# EAGLE schematic DMM-8E-2 (EAGLE 6.6.0)
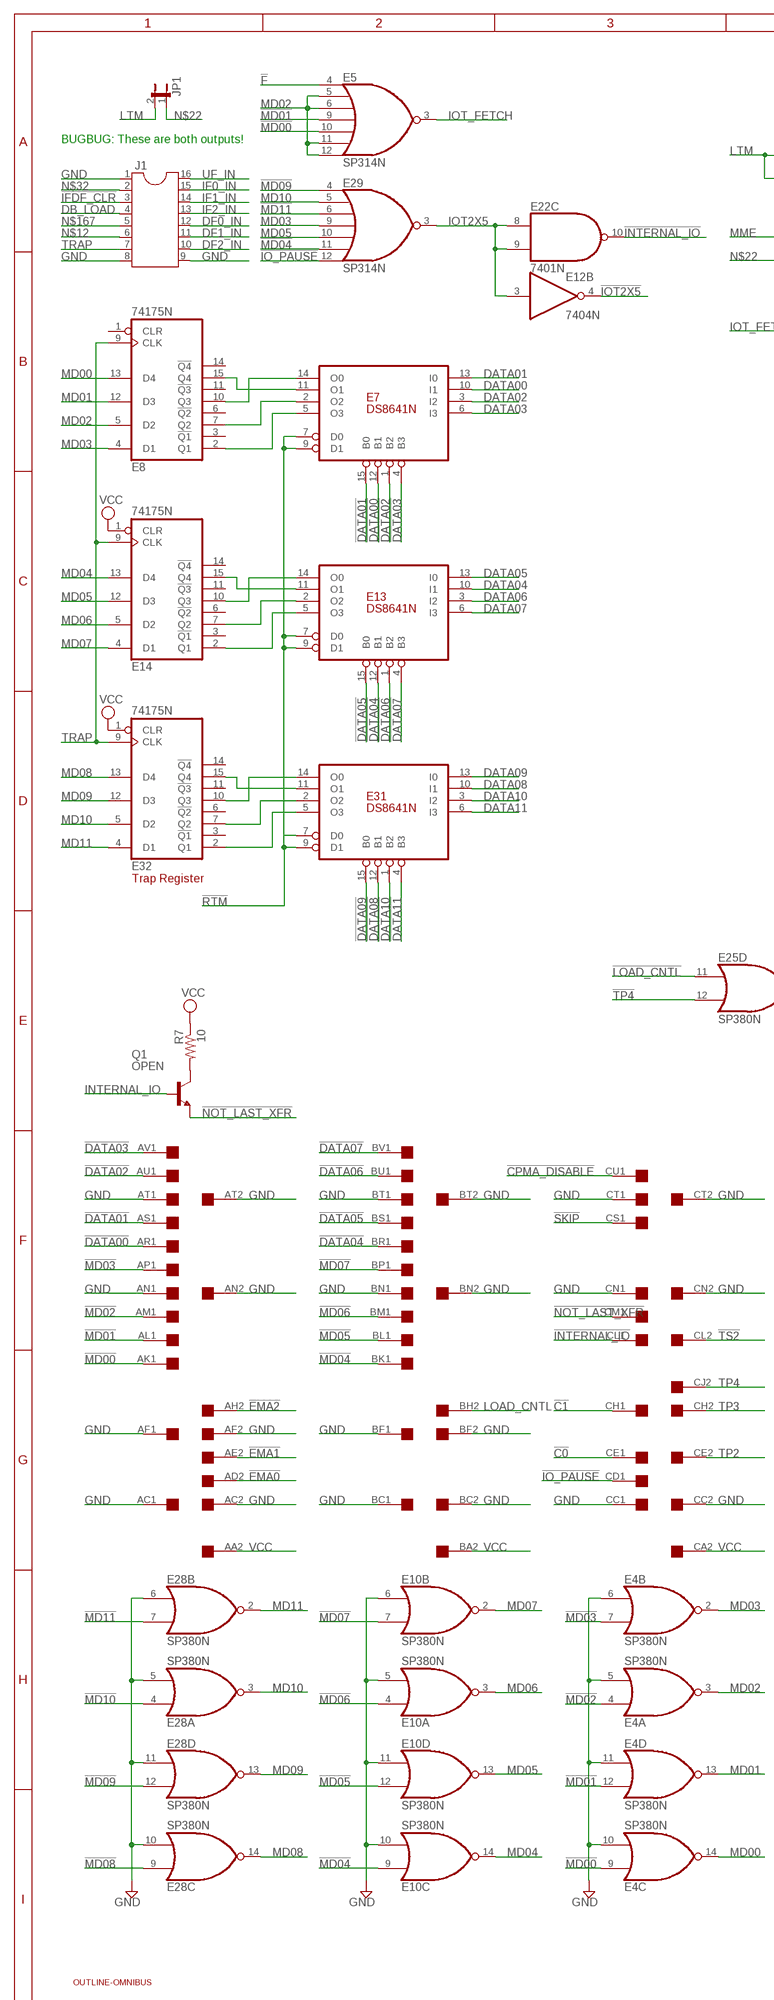
[diagram p0: schematic, sheet 1, part 1 of 2]
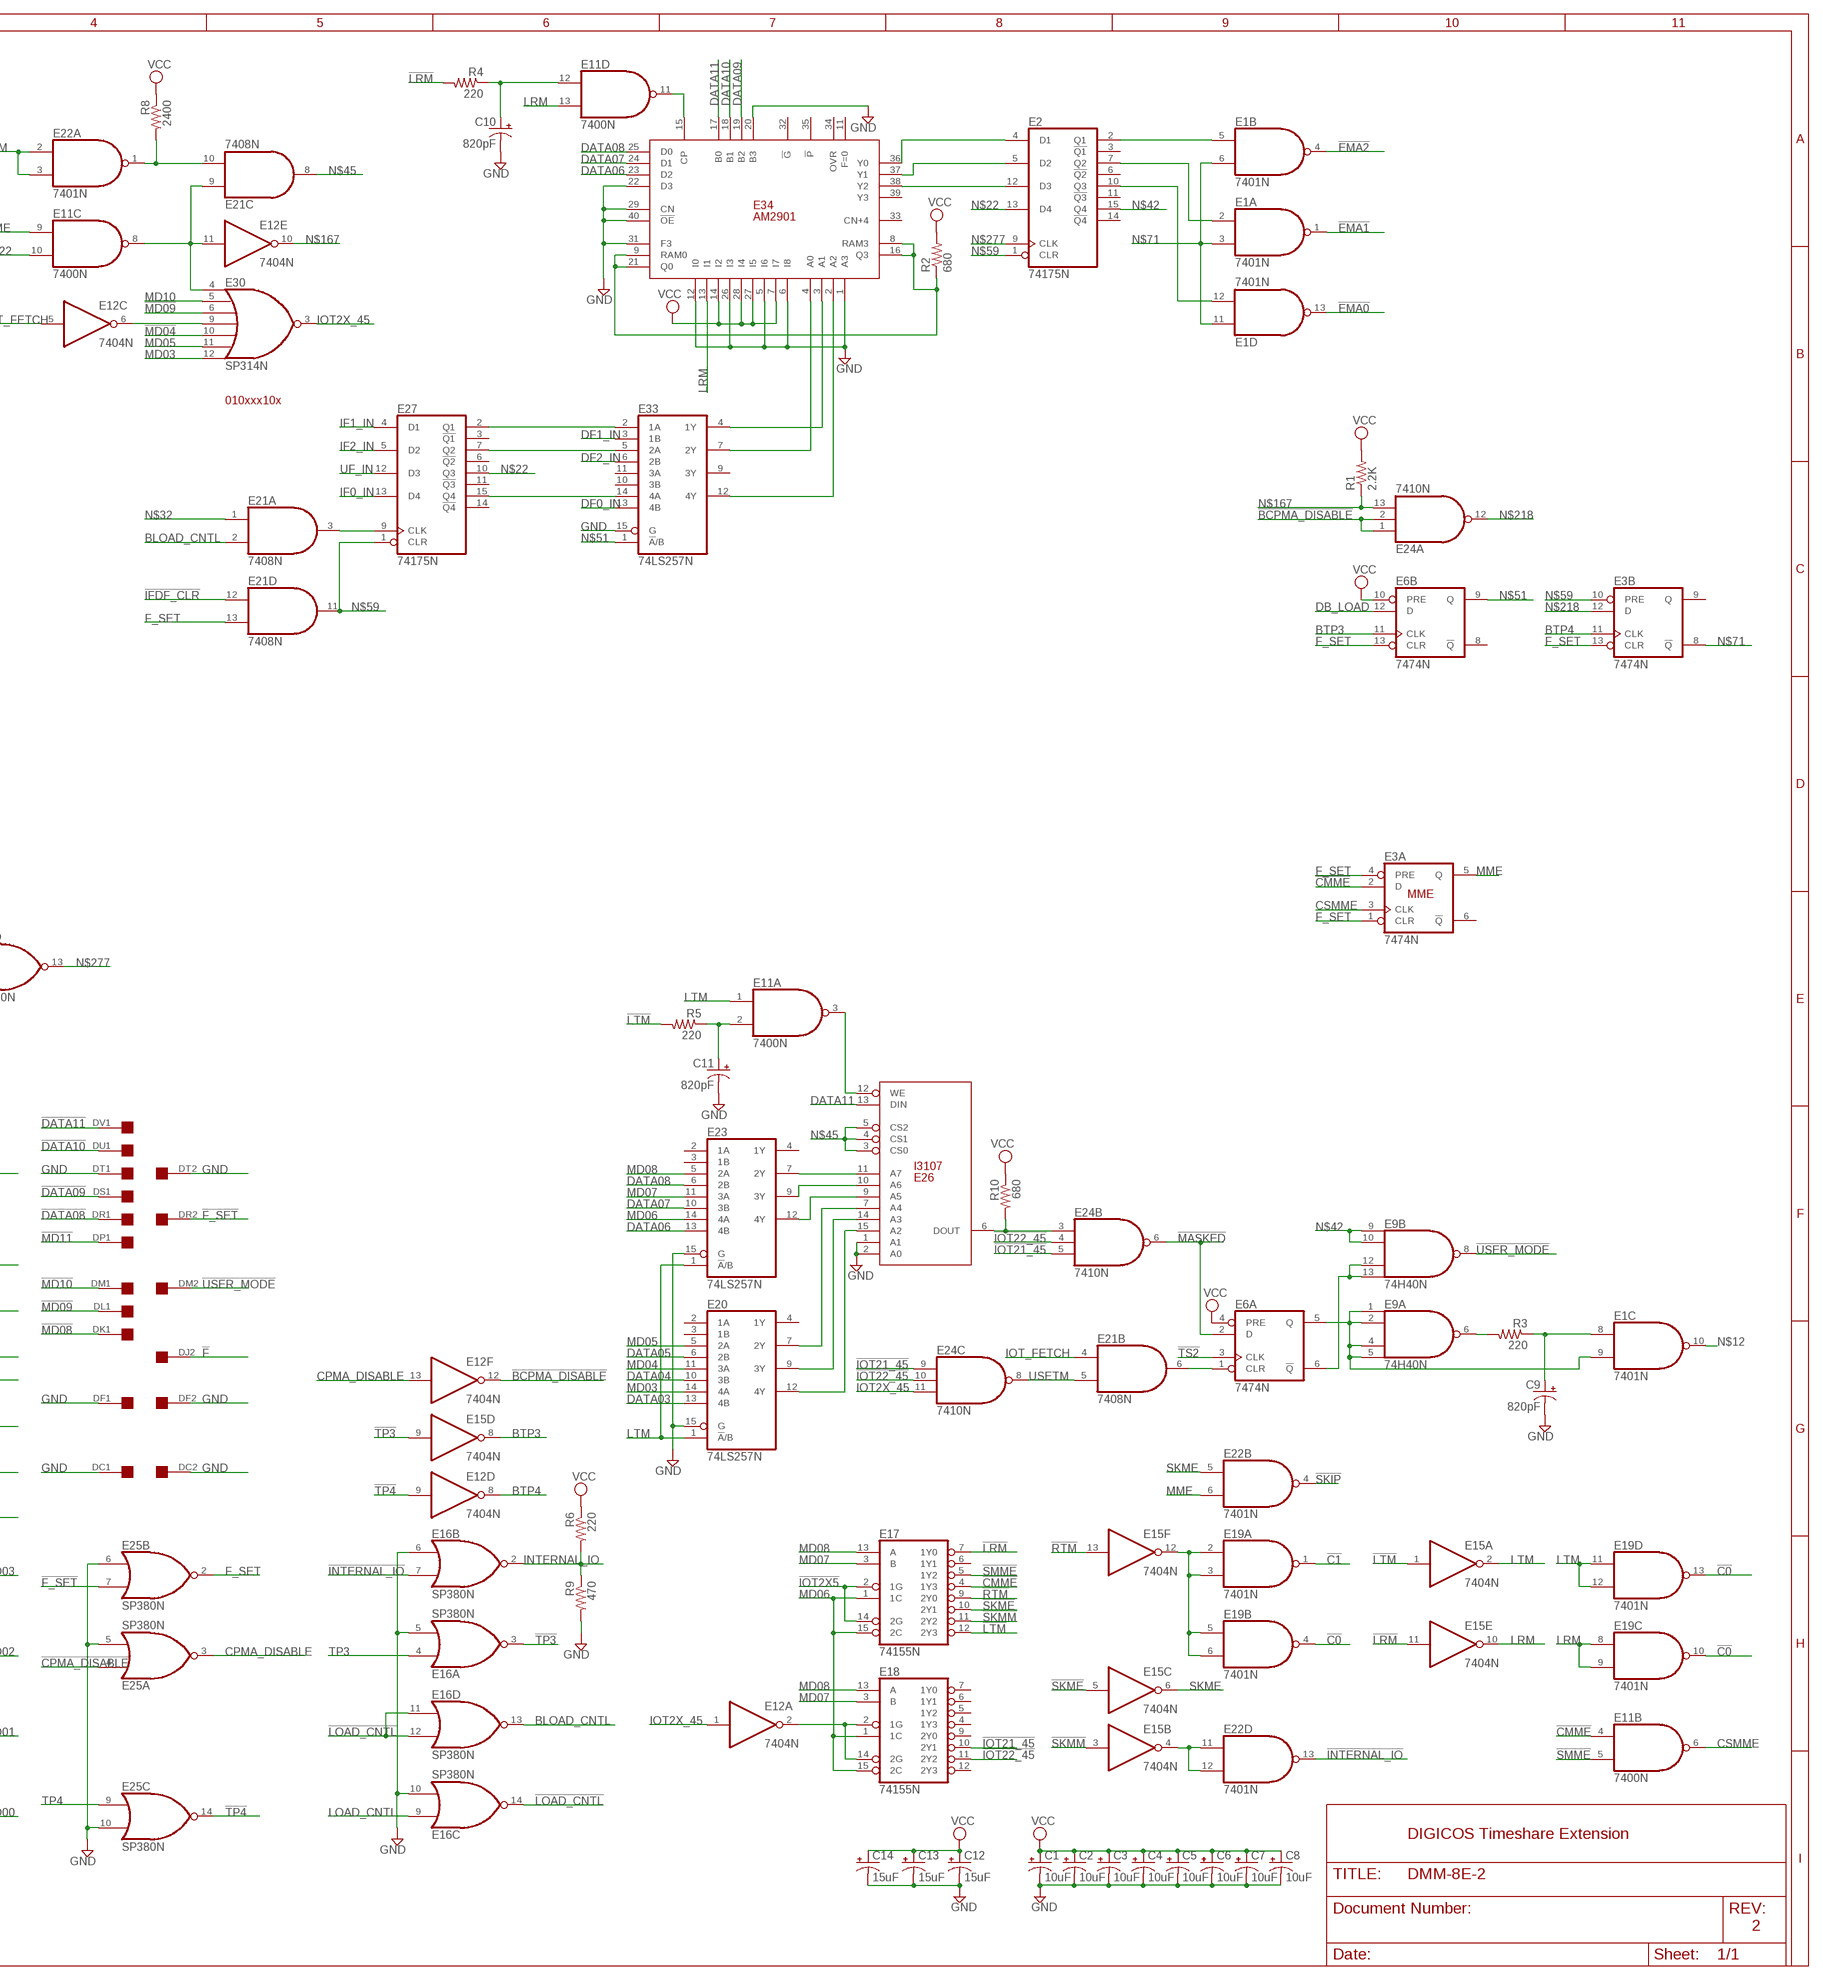
[diagram p1: schematic, sheet 1, part 2 of 2]

## Parts
C1  10uF  CPOL-USE15-5AXIAL  [E15-5]
C2  10uF  CPOL-USE15-5AXIAL  [E15-5]
C3  10uF  CPOL-USE15-5AXIAL  [E15-5]
C4  10uF  CPOL-USE15-5AXIAL  [E15-5]
C5  10uF  CPOL-USE15-5AXIAL  [E15-5]
C6  10uF  CPOL-USE15-5AXIAL  [E15-5]
C7  10uF  CPOL-USE15-5AXIAL  [E15-5]
C8  10uF  CPOL-USE15-5AXIAL  [E15-5]
C9  820pF  CPOL-USB45181C  [B45181C]
C10  820pF  CPOL-USB45181C  [B45181C]
C11  820pF  CPOL-USB45181C  [B45181C]
C12  15uF  CPOL-USTT5D7  [TT5D7]
C13  15uF  CPOL-USTT5D7  [TT5D7]
C14  15uF  CPOL-USTT5D7  [TT5D7]
E1  7401N  74LS01N  [DIL14]
E2  74175N  [DIL16]
E3  7474N  74LS74N  [DIL14]
E4  SP380N  [DIL14]
E5  SP314N  [DIL14]
E6  7474N  74LS74N  [DIL14]
E7  DS8641N  [DIL16]
E8  74175N  [DIL16]
E9  74H40N  7440N  [DIL14]
E10  SP380N  [DIL14]
E11  7400N  [DIL14]
E12  7404N  [DIL14]
E13  DS8641N  [DIL16]
E14  74175N  [DIL16]
E15  7404N  [DIL14]
E16  SP380N  [DIL14]
E17  74155N  [DIL16]
E18  74155N  [DIL16]
E19  7401N  74LS01N  [DIL14]
E20  74LS257N  [DIL16]
E21  7408N  74LS08N  [DIL14]
E22  7401N  74LS01N  [DIL14]
E23  74LS257N  [DIL16]
E24  7410N  [DIL14]
E25  SP380N  [DIL14]
E26  I3107  [DIL16]
E27  74175N  [DIL16]
E28  SP380N  [DIL14]
E29  SP314N  [DIL14]
E30  SP314N  [DIL14]
E31  DS8641N  [DIL16]
E32  74175N  [DIL16]
E33  74LS257N  [DIL16]
E34  AM2901  [DIL40]
J1  DIL16S  [SOCKET-16]
JP1  JP1E  [JP1]
Q1  OPEN  -NPN-TO5  [TO5]
R1  2.2K  R-US_0207/10  [0207/10]
R2  680  R-US_0207/10  [0207/10]
R3  220  R-US_0207/10  [0207/10]
R4  220  R-US_0207/10  [0207/10]
R5  220  R-US_0207/10  [0207/10]
R6  220  R-US_0207/10  [0207/10]
R7  10  R-US_0207/10  [0207/10]
R8  2400  R-US_0207/10  [0207/10]
R9  470  R-US_0207/10  [0207/10]
R10  680  R-US_0207/10  [0207/10]
U$1  OUTLINE-OMNIBUS  [OMNIBUS]
U$2  QUAD  [EDGE-CON8]

## Nets
!BCPMA_DISABLE: E12.12(F:O) E24.1(A:I0) E24.2(A:I1)
!C0: E19.4(B:O) E19.10(C:O) E19.13(D:O) U$2.CE1
!C1: E19.1(A:O) U$2.CH1
!CMME: E3.2(A:D) E11.4(B:I0) E17.4(1Y3)
!CPMA_DISABLE: E25.4(A:I0) U$2.CU1
!DATA00: E7.12(B1) U$2.AR1
!DATA01: E7.15(B0) U$2.AS1
!DATA02: E7.1(B2) U$2.AU1
!DATA03: E7.4(B3) U$2.AV1
!DATA04: E13.12(B1) U$2.BR1
!DATA05: E13.15(B0) U$2.BS1
!DATA06: E13.1(B2) U$2.BU1
!DATA07: E13.4(B3) U$2.BV1
!DATA08: E31.12(B1) U$2.DR1
!DATA09: E31.15(B0) U$2.DS1
!DATA10: E31.1(B2) U$2.DU1
!DATA11: E31.4(B3) U$2.DV1
!EMA0: E1.13(D:O) U$2.AD2
!EMA1: E1.1(A:O) U$2.AE2
!EMA2: E1.4(B:O) U$2.AH2
!F: E5.4(I0) U$2.DJ2
!F_SET: E25.7(B:I1) U$2.DR2
!IFDF_CLR: E21.12(D:I0) J1.3
!INTERNAL_IO: E16.7(B:I1) E22.10(C:O) E22.13(D:O) U$2.CL1
!IO_PAUSE: E29.12(I6) U$2.CD1
!IOT2X5: E12.4(B:O) E17.2(1G) E17.14(2G)
!IOT21_45: E18.10(2Y1) E24.5(B:I2) E24.9(C:I0)
!IOT22_45: E18.11(2Y2) E24.4(B:I1) E24.10(C:I1)
!LOAD_CNTL: E16.11(D:I0) E16.12(D:I1) E16.14(C:O) E25.11(D:I0)
!LRM: E15.11(E:I) E17.7(1Y0) R4.2
!LTM: E15.1(A:I) E17.12(2Y3) R5.2
!MASKED: E6.2(A:D) E24.6(B:O)
!MD00: E4.9(C:I0) E5.10(I4) U$2.AK1
!MD01: E4.12(D:I1) E5.9(I3) U$2.AL1
!MD02: E4.4(A:I0) U$2.AM1
!MD03: E4.7(B:I1) U$2.AP1
!MD04: E10.9(C:I0) E29.11(I5) E30.10(I4) U$2.BK1
!MD05: E10.12(D:I1) U$2.BL1
!MD06: E10.4(A:I0) U$2.BM1
!MD07: E10.7(B:I1) U$2.BP1
!MD08: E28.9(C:I0) U$2.DK1
!MD09: E28.12(D:I1) E29.4(I0) E30.6(I2) U$2.DL1
!MD10: E28.4(A:I0) U$2.DM1
!MD11: E28.7(B:I1) E29.6(I2) U$2.DP1
!NOT_LAST_XFR: Q1.1(E) U$2.CM1
!RTM: E7.7(D0) E7.9(D1) E13.7(D0) E13.9(D1) E15.13(F:I) E17.9(2Y0) E31.7(D0) E31.9(D1)
!SKIP: E22.4(B:O) U$2.CS1
!SKME: E15.5(C:I) E17.10(2Y1)
!SKMM: E15.3(B:I) E17.11(2Y2)
!SMME: E11.5(B:I1) E17.5(1Y2)
!TP3: E15.9(D:I) E16.3(A:O)
!TP4: E12.9(D:I) E25.12(D:I1) E25.14(C:O)
!TS2: E6.3(A:CLK) U$2.CL2
!USER_MODE: E9.8(B:O) U$2.DM2
BLOAD_CNTL: E16.13(D:O) E21.2(A:I1)
BTP3: E6.11(B:CLK) E15.8(D:O)
BTP4: E3.11(B:CLK) E12.8(D:O)
CPMA_DISABLE: E12.13(F:I) E25.3(A:O)
CSMME: E3.3(A:CLK) E11.6(B:O)
DATA00: E7.10(I1)
DATA01: E7.13(I0)
DATA02: E7.3(I2)
DATA03: E7.6(I3) E20.13(4B)
DATA04: E13.10(I1) E20.10(3B)
DATA05: E13.13(I0) E20.6(2B)
DATA06: E13.3(I2) E23.13(4B) E34.23(D2)
DATA07: E13.6(I3) E23.10(3B) E34.24(D1)
DATA08: E23.6(2B) E31.10(I1) E34.25(D0)
DATA09: E31.13(I0) E34.19(B2)
DATA10: E31.3(I2) E34.18(B1)
DATA11: E26.13(DIN) E31.6(I3) E34.17(B0)
DB_LOAD: E6.12(B:D) J1.4
DF0_IN: E33.13(4B) J1.12
DF1_IN: E33.3(1B) J1.11
DF2_IN: E33.6(2B) J1.10
F_SET: E3.1(A:CLR) E3.4(A:PRE) E3.13(B:CLR) E6.13(B:CLR) E21.13(D:I1) E25.2(B:O)
GND: C1.- C2.- C3.- C4.- C5.- C6.- C7.- C8.- C9.- C10.- C11.- C12.- C13.- C14.- E4.5(A:I1) E4.6(B:I0) E4.10(C:I1) E4.11(D:I0) E10.5(A:I1) E10.6(B:I0) E10.10(C:I1) E10.11(D:I0) E16.5(A:I1) E16.6(B:I0) E16.10(C:I1) E20.15(G) E23.15(G) E25.5(A:I1) E25.6(B:I0) E25.10(C:I1) E26.1(A1) E26.2(A0) E28.5(A:I1) E28.6(B:I0) E28.10(C:I1) E28.11(D:I0) E33.15(G) E34.1(A3) E34.5(I6) E34.6(I8) E34.12(I0) E34.20(B3) E34.22(D3) E34.26(I3) E34.29(CN) E34.31(F3) E34.40(!OE) J1.1 J1.8 J1.9 R9.2 U$2.AC1 U$2.AC2 U$2.AF1 U$2.AF2 U$2.AN1 U$2.AN2 U$2.AT1 U$2.AT2 U$2.BC1 U$2.BC2 U$2.BF1 U$2.BF2 U$2.BN1 U$2.BN2 U$2.BT1 U$2.BT2 U$2.CC1 U$2.CC2 U$2.CN1 U$2.CN2 U$2.CT1 U$2.CT2 U$2.DC1 U$2.DC2 U$2.DF1 U$2.DF2 U$2.DT1 U$2.DT2
IF0_IN: E27.13(D4) J1.15
IF1_IN: E27.4(D1) J1.14
IF2_IN: E27.5(D2) J1.13
INTERNAL_IO: E16.2(B:O) Q1.2(B) R6.2 R9.1
IOT2X5: E12.3(B:I) E22.8(C:I0) E22.9(C:I1) E29.3(O)
IOT2X_45: E12.1(A:I) E24.11(C:I2) E30.3(O)
IOT_FETCH: E5.3(O) E12.5(C:I) E21.4(B:I0)
LOAD_CNTL: E16.9(C:I0) U$2.BH2
LRM: E11.13(D:I1) E15.10(E:O) E19.8(C:I0) E19.9(C:I1) E34.13(I1)
LTM: E11.1(A:I0) E15.2(A:O) E19.11(D:I0) E19.12(D:I1) E20.1(!A!/B) E22.2(A:I0) E22.3(A:I1) E23.1(!A!/B) JP1.2
MD00: E4.14(C:O) E8.13(D4)
MD01: E4.13(D:O) E8.12(D3)
MD02: E4.3(A:O) E5.5(I1) E5.6(I2) E5.11(I5) E5.12(I6) E8.5(D2)
MD03: E4.2(B:O) E8.4(D1) E20.14(4A) E29.9(I3) E30.12(I6)
MD04: E10.14(C:O) E14.13(D4) E20.11(3A)
MD05: E10.13(D:O) E14.12(D3) E20.5(2A) E29.10(I4) E30.11(I5)
MD06: E10.3(A:O) E14.5(D2) E17.1(1C) E17.15(2C) E18.1(1C) E18.15(2C) E23.14(4A)
MD07: E10.2(B:O) E14.4(D1) E17.3(B) E18.3(B) E23.11(3A)
MD08: E17.13(A) E18.13(A) E23.5(2A) E28.14(C:O) E32.13(D4)
MD09: E28.13(D:O) E32.12(D3)
MD10: E28.3(A:O) E29.5(I1) E30.5(I1) E32.5(D2)
MD11: E28.2(B:O) E32.4(D1)
MME: E3.5(A:Q) E11.9(C:I0) E22.6(B:I1)
N$1: E2.4(D1) E34.36(Y0)
N$2: E2.5(D2) E34.37(Y1)
N$3: E2.12(D3) E34.38(Y2)
N$4: E20.12(4Y) E26.15(A2)
N$5: E20.7(2Y) E26.7(A4)
N$6: E11.3(A:O) E26.12(WE)
N$10: C9.+ E1.8(C:I0) R3.1
N$11: E1.9(C:I1) E6.5(A:Q) E9.1(A:I0) E9.2(A:I1) E9.4(A:I2) E9.5(A:I3)
N$12: E1.10(C:O) J1.6
N$16: E34.8(RAM3) E34.9(RAM0) E34.16(Q3) E34.21(Q0) R2.1
N$18: E9.6(A:O) R3.2
N$20: E23.12(4Y) E26.9(A5)
N$21: E20.9(3Y) E26.14(A3)
N$22: E2.13(D4) E11.10(C:I1) E27.10(Q3) JP1.1
N$29: E23.9(3Y) E26.10(A6)
N$31: E23.7(2Y) E26.11(A7)
N$32: E21.1(A:I0) J1.2
N$33: E24.3(B:I0) E26.6(DOUT) R10.2
N$42: E2.15(Q4) E9.9(B:I0) E9.10(B:I1)
N$45: E21.8(C:O) E26.3(CS0) E26.4(CS1) E26.5(CS2)
N$48: E12.6(C:O) E30.9(I3)
N$51: E6.9(B:Q) E33.1(!A!/B)
N$52: E11.11(D:O) E34.15(CP)
N$54: E33.7(2Y) E34.4(A0)
N$55: E33.4(1Y) E34.3(A1)
N$56: E33.12(4Y) E34.2(A2)
N$59: E2.1(CLR) E3.10(B:PRE) E21.11(D:O) E27.1(CLR)
N$60: C10.+ E11.12(D:I0) R4.1
N$71: E1.3(A:I1) E1.6(B:I1) E1.11(D:I0) E3.8(B:!Q)
N$72: E1.5(B:I0) E2.2(Q1)
N$73: E1.2(A:I0) E2.7(Q2)
N$74: E1.12(D:I1) E2.10(Q3)
N$77: E31.11(O1) E32.15(Q4)
N$78: E31.14(O0) E32.10(Q3)
N$80: E31.5(O3) E32.2(Q1)
N$81: E31.2(O2) E32.7(Q2)
N$83: E13.11(O1) E14.15(Q4)
N$84: E13.14(O0) E14.10(Q3)
N$86: E13.5(O3) E14.2(Q1)
N$87: E13.2(O2) E14.7(Q2)
N$89: E7.11(O1) E8.15(Q4)
N$90: E7.14(O0) E8.10(Q3)
N$91: E21.10(C:I1) E22.1(A:O) R8.2
N$92: E7.5(O3) E8.2(Q1)
N$93: E7.2(O2) E8.7(Q2)
N$94: C11.+ E11.2(A:I1) R5.1
N$97: Q1.3(C) R7.2
N$143: E27.2(Q1) E33.2(1A)
N$145: E27.7(Q2) E33.5(2A)
N$149: E27.15(Q4) E33.14(4A)
N$167: E12.10(E:O) E24.13(A:I2) J1.5 R1.1
N$185: E11.8(C:O) E12.11(E:I) E21.9(C:I0) E30.4(I0)
N$213: E21.3(A:O) E27.9(CLK)
N$218: E3.12(B:D) E24.12(A:O)
N$277: E2.9(CLK) E25.13(D:O)
N$308: E12.2(A:O) E18.2(1G) E18.14(2G)
N$322: E6.1(A:CLR) E21.6(B:O)
N$338: E6.6(A:!Q) E9.12(B:I2) E9.13(B:I3)
N$406: E15.4(B:O) E22.11(D:I0) E22.12(D:I1)
N$409: E15.12(F:O) E19.2(A:I0) E19.3(A:I1) E19.5(B:I0) E19.6(B:I1)
SKME: E15.6(C:O) E22.5(B:I0)
TP2: U$2.CE2
TP3: E16.4(A:I0) U$2.CH2
TP4: E25.9(C:I0) U$2.CJ2
TRAP: E8.9(CLK) E14.9(CLK) E32.9(CLK) J1.7
UF_IN: E27.12(D3) J1.16
USETM: E21.5(B:I1) E24.8(C:O)
VCC: C1.+ C2.+ C3.+ C4.+ C5.+ C6.+ C7.+ C8.+ C12.+ C13.+ C14.+ E6.4(A:PRE) E6.10(B:PRE) E14.1(CLR) E32.1(CLR) E34.7(I7) E34.14(I2) E34.27(I5) E34.28(I4) R1.2 R2.2 R6.1 R7.1 R8.1 R10.1 U$2.AA2 U$2.BA2 U$2.CA2
Unconnected: E2.3(!Q1) E2.6(!Q2) E2.11(!Q3) E2.14(!Q4) E3.6(A:!Q) E3.9(B:Q) E5.2(NC) E5.7(NC) E5.13(NC) E5.14(NC) E6.8(B:!Q) E8.1(CLR) E8.3(!Q1) E8.6(!Q2) E8.11(!Q3) E8.14(!Q4) E9.3(3:NC) E9.11(11:NC) E14.3(!Q1) E14.6(!Q2) E14.11(!Q3) E14.14(!Q4) E17.6(1Y1) E18.4(1Y3) E18.5(1Y2) E18.6(1Y1) E18.7(1Y0) E18.9(2Y0) E18.12(2Y3) E20.2(1A) E20.3(1B) E20.4(1Y) E23.2(1A) E23.3(1B) E23.4(1Y) E27.3(!Q1) E27.6(!Q2) E27.11(!Q3) E27.14(!Q4) E29.2(NC) E29.7(NC) E29.13(NC) E29.14(NC) E30.2(NC) E30.7(NC) E30.13(NC) E30.14(NC) E32.3(!Q1) E32.6(!Q2) E32.11(!Q3) E32.14(!Q4) E33.9(3Y) E33.10(3B) E33.11(3A) E34.11(F=0) E34.32(!G) E34.33(CN+4) E34.34(OVR) E34.35(!P) E34.39(Y3) U$2.AA1 U$2.AB1 U$2.AB2 U$2.AD1 U$2.AE1 U$2.AH1 U$2.AJ1 U$2.AJ2 U$2.AK2 U$2.AL2 U$2.AM2 U$2.AP2 U$2.AR2 U$2.AS2 U$2.AU2 U$2.AV2 U$2.BA1 U$2.BB1 U$2.BB2 U$2.BD1 U$2.BD2 U$2.BE1 U$2.BE2 U$2.BH1 U$2.BJ1 U$2.BJ2 U$2.BK2 U$2.BL2 U$2.BM2 U$2.BP2 U$2.BR2 U$2.BS2 U$2.BU2 U$2.BV2 U$2.CA1 U$2.CB1 U$2.CB2 U$2.CD2 U$2.CF1 U$2.CF2 U$2.CJ1 U$2.CK1 U$2.CK2 U$2.CM2 U$2.CP1 U$2.CP2 U$2.CR1 U$2.CR2 U$2.CS2 U$2.CU2 U$2.CV1 U$2.CV2 U$2.DA1 U$2.DA2 U$2.DB1 U$2.DB2 U$2.DD1 U$2.DD2 U$2.DE1 U$2.DE2 U$2.DH1 U$2.DH2 U$2.DJ1 U$2.DK2 U$2.DL2 U$2.DN1 U$2.DN2 U$2.DP2 U$2.DS2 U$2.DU2 U$2.DV2

## Notes on the sheet
- BUGBUG: These are both outputs!
- 010xxx10x
- Trap Register
- MME
- DIGICOS Timeshare Extension
- 2

## Power pins joined to a net without a drawn wire
GND: E1.7(P:GND) E2.8(GND) E3.7(P:GND) E4.1(P:GND) E5.1(GND) E6.7(P:GND) E7.8(GND) E8.8(GND) E9.7(P:GND) E10.1(P:GND) E11.7(P:GND) E12.7(P:GND) E13.8(GND) E14.8(GND) E15.7(P:GND) E16.1(P:GND) E17.8(GND) E18.8(GND) E19.7(P:GND) E20.8(GND) E21.7(P:GND) E22.7(P:GND) E23.8(GND) E24.7(P:GND) E25.1(P:GND) E26.8(GND) E27.8(GND) E28.1(P:GND) E29.1(GND) E30.1(GND) E31.8(GND) E32.8(GND) E33.8(GND) E34.30(GND)
VCC: E1.14(P:VCC) E2.16(VCC) E3.14(P:VCC) E4.8(P:VCC) E5.8(VCC) E6.14(P:VCC) E7.16(VCC) E8.16(VCC) E9.14(P:VCC) E10.8(P:VCC) E11.14(P:VCC) E12.14(P:VCC) E13.16(VCC) E14.16(VCC) E15.14(P:VCC) E16.8(P:VCC) E17.16(VCC) E18.16(VCC) E19.14(P:VCC) E20.16(VCC) E21.14(P:VCC) E22.14(P:VCC) E23.16(VCC) E24.14(P:VCC) E25.8(P:VCC) E26.16(VCC) E27.16(VCC) E28.8(P:VCC) E29.8(VCC) E30.8(VCC) E31.16(VCC) E32.16(VCC) E33.16(VCC) E34.10(VCC)

## Library data of the parts
C1-C14 = rcl:CPOL-US: POLARIZED CAPACITOR, American symbol
E1 E19 E22 = 74xx-us:74*01: Quad 2-input NAND gate, open collector
E2 E8 E14 E27 E32 = 74xx-us:74*175: Qadruple D type FLIP FLOP, clear
E3 E6 = 74xx-us:74*74: Dual D type positive edge triggered FLIP FLOP, preset and clear
E4 E10 E16 E25 E28 = dec-con:SP380: Quad NOR gate (use 8640)
E5 E29 E30 = dec-con:SP314: 7-Input NOR gate
E7 E13 E31 = dec-con:DS8641: Quad Bus Tranceiver
E9 = dec-con:74*40: Dual 4-input NAND gate
E11 = 74xx-us:74*00: Quad 2-input NAND gate
E12 E15 = 74xx-us:74*04: Hex INVERTER
E17 E18 = 74xx-us:74*155: Dual 2-line to 4-line data DECODER/DEMULTIPLEXER
E20 E23 E33 = 74xx-us:74*257: Quadruple 2-to 1 line data SELECTOR/MULTIPLEXER
E21 = 74xx-us:74*08: Quad 2-input AND gate
E24 = 74xx-us:74*10: Triple 3-input NAND gate
E26 = dec-con:I3107: 256 Bit RAM
E34 = dec-con:AM2901: AM2901 Microprocessor Slice
J1 = ic-package:DIL16: Dual In Line / Socket
JP1 = jumper:JP1E: JUMPER
Q1 = transistor:*-NPN-: NPN Transistror BF959 corrected 2008.03.06
R1-R10 = rcl:R-US_: RESISTOR, American symbol
U$1 = dec-con:OUTLINE-*: Board outlines for DEC boards.
U$2 = dec-con:QUAD: Quad-Height DEC board